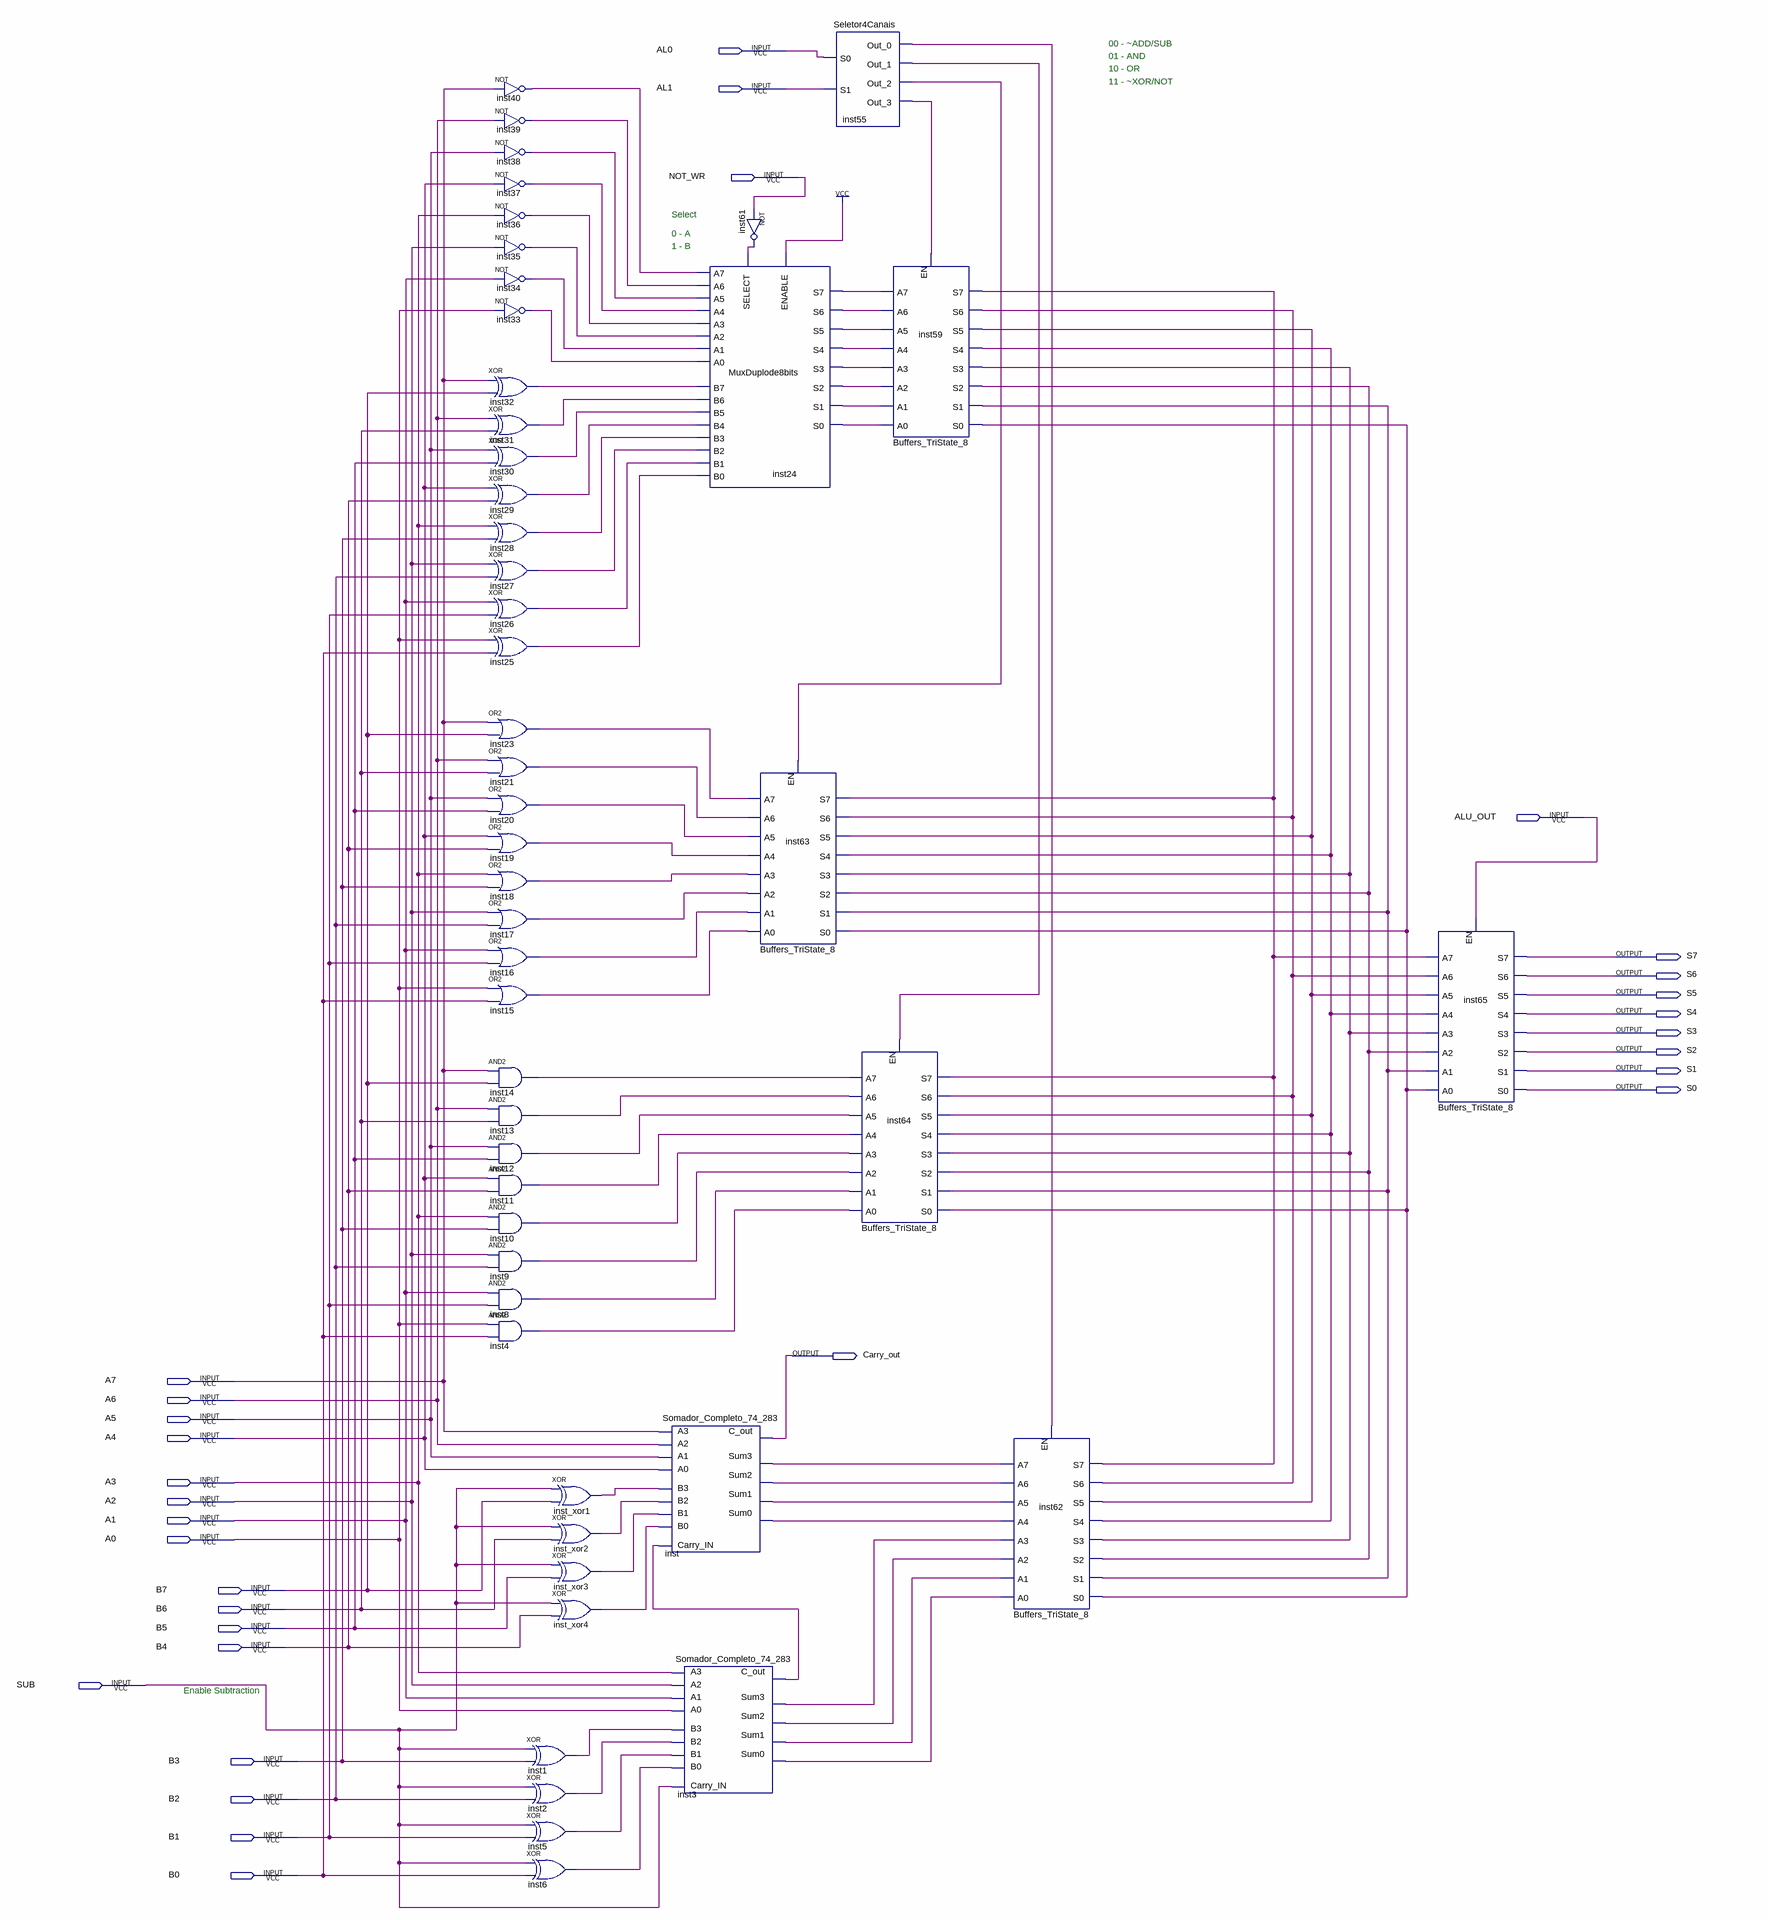
[diagram p0: schematic sheet]
// Quartus schematic ULA_Iago.bdf as structural Verilog: 50 symbols, 30 pins
module ULA_Iago (
  input  AL0,
  input  AL1,
  input  NOT_WR,
  input  ALU_OUT,
  input  A7,
  input  A6,
  input  A5,
  input  A4,
  input  A3,
  input  A2,
  input  A1,
  input  A0,
  input  B7,
  input  B6,
  input  B5,
  input  B4,
  input  SUB,
  input  B3,
  input  B2,
  input  B1,
  input  B0,
  output S7,
  output S6,
  output S5,
  output S4,
  output S3,
  output S2,
  output S1,
  output S0,
  output Carry_out
);

  wire inst1_out, inst2_out, inst3_c_out, inst3_sum0, inst3_sum1, inst3_sum2, inst3_sum3, inst4_out,
       inst5_out, inst6_out, inst8_out, inst9_out, inst10_out, inst11_out, inst12_out, inst13_out,
       inst14_out, inst15_out, inst16_out, inst17_out, inst18_out, inst19_out, inst20_out, inst21_out,
       inst23_out, inst24_s0, inst24_s1, inst24_s2, inst24_s3, inst24_s4, inst24_s5, inst24_s6, inst24_s7,
       inst25_out, inst26_out, inst27_out, inst28_out, inst29_out, inst30_out, inst31_out, inst32_out,
       inst33_out, inst34_out, inst35_out, inst36_out, inst37_out, inst38_out, inst39_out, inst40_out,
       inst55_out_0, inst55_out_1, inst55_out_2, inst55_out_3, inst61_out, inst63_s0, inst63_s1, inst63_s2,
       inst63_s3, inst63_s4, inst63_s5, inst63_s6, inst63_s7, inst_sum0, inst_sum1, inst_sum2, inst_sum3,
       inst_xor1_out, inst_xor2_out, inst_xor3_out, inst_xor4_out;

  not inst40 (inst40_out, A7);
  not inst39 (inst39_out, A6);
  not inst38 (inst38_out, A5);
  not inst37 (inst37_out, A4);
  not inst36 (inst36_out, A3);
  not inst35 (inst35_out, A2);
  not inst34 (inst34_out, A1);
  not inst33 (inst33_out, A0);
  xor inst32 (inst32_out, A7, B7);
  xor inst31 (inst31_out, A6, B6);
  xor inst30 (inst30_out, A5, B5);
  xor inst29 (inst29_out, A4, B4);
  xor inst28 (inst28_out, A3, B3);
  xor inst27 (inst27_out, A2, B2);
  xor inst26 (inst26_out, A1, B1);
  xor inst25 (inst25_out, A0, B0);
  or inst23 (inst23_out, A7, B7);
  or inst21 (inst21_out, A6, B6);
  or inst20 (inst20_out, A5, B5);
  or inst19 (inst19_out, A4, B4);
  or inst18 (inst18_out, A3, B3);
  or inst17 (inst17_out, A2, B2);
  or inst16 (inst16_out, A1, B1);
  or inst15 (inst15_out, A0, B0);
  and inst14 (inst14_out, A7, B7);
  and inst13 (inst13_out, A6, B6);
  and inst12 (inst12_out, A5, B5);
  and inst11 (inst11_out, A4, B4);
  and inst10 (inst10_out, A3, B3);
  and inst9 (inst9_out, A2, B2);
  and inst8 (inst8_out, A1, B1);
  and inst4 (inst4_out, A0, B0);
  xor inst_xor1 (inst_xor1_out, SUB, B7);
  xor inst_xor2 (inst_xor2_out, SUB, B6);
  xor inst_xor3 (inst_xor3_out, SUB, B5);
  xor inst_xor4 (inst_xor4_out, SUB, B4);
  xor inst1 (inst1_out, SUB, B3);
  xor inst2 (inst2_out, SUB, B2);
  xor inst5 (inst5_out, SUB, B1);
  xor inst6 (inst6_out, SUB, B0);
  Somador_Completo_74_283 inst (
    .B3(inst_xor1_out), .A3(A7), .B2(inst_xor2_out), .A2(A6), .B1(inst_xor3_out), .A1(A5),
    .B0(inst_xor4_out), .A0(A4), .Carry_IN(inst3_c_out), .C_out(Carry_out), .Sum3(inst_sum3),
    .Sum2(inst_sum2), .Sum0(inst_sum0), .Sum1(inst_sum1));
  MuxDuplode8bits inst24 (
    .SELECT(inst61_out), .ENABLE(1'b1), .A7(inst40_out), .B7(inst32_out), .A6(inst39_out), .B6(inst31_out),
    .A5(inst38_out), .B5(inst30_out), .A4(inst37_out), .B4(inst29_out), .A3(inst36_out), .B3(inst28_out),
    .A2(inst35_out), .B2(inst27_out), .A1(inst34_out), .B1(inst26_out), .A0(inst33_out), .B0(inst25_out),
    .S7(inst24_s7), .S6(inst24_s6), .S5(inst24_s5), .S4(inst24_s4), .S3(inst24_s3), .S2(inst24_s2),
    .S1(inst24_s1), .S0(inst24_s0));
  Somador_Completo_74_283 inst3 (
    .B3(inst1_out), .A3(A3), .B2(inst2_out), .A2(A2), .B1(inst5_out), .A1(A1), .B0(inst6_out), .A0(A0),
    .Carry_IN(SUB), .C_out(inst3_c_out), .Sum3(inst3_sum3), .Sum2(inst3_sum2), .Sum0(inst3_sum0),
    .Sum1(inst3_sum1));
  not inst61 (inst61_out, NOT_WR);
  Buffers_TriState_8 inst63 (
    .EN(inst55_out_2), .A7(inst23_out), .A6(inst21_out), .A5(inst20_out), .A4(inst19_out), .A3(inst18_out),
    .A2(inst17_out), .A1(inst16_out), .A0(inst15_out), .S7(inst63_s7), .S6(inst63_s6), .S5(inst63_s5),
    .S4(inst63_s4), .S3(inst63_s3), .S2(inst63_s2), .S1(inst63_s1), .S0(inst63_s0));
  Seletor4Canais inst55 (
    .S0(AL0), .S1(AL1), .Out_0(inst55_out_0), .Out_1(inst55_out_1), .Out_2(inst55_out_2), .Out_3(inst55_out_3));
  Buffers_TriState_8 inst64 (
    .EN(inst55_out_1), .A7(inst14_out), .A6(inst13_out), .A5(inst12_out), .A4(inst11_out), .A3(inst10_out),
    .A2(inst9_out), .A1(inst8_out), .A0(inst4_out), .S7(inst63_s7), .S6(inst63_s6), .S5(inst63_s5),
    .S4(inst63_s4), .S3(inst63_s3), .S2(inst63_s2), .S1(inst63_s1), .S0(inst63_s0));
  Buffers_TriState_8 inst59 (
    .EN(inst55_out_3), .A7(inst24_s7), .A6(inst24_s6), .A5(inst24_s5), .A4(inst24_s4), .A3(inst24_s3),
    .A2(inst24_s2), .A1(inst24_s1), .A0(inst24_s0), .S7(inst63_s7), .S6(inst63_s6), .S5(inst63_s5),
    .S4(inst63_s4), .S3(inst63_s3), .S2(inst63_s2), .S1(inst63_s1), .S0(inst63_s0));
  Buffers_TriState_8 inst62 (
    .EN(inst55_out_0), .A7(inst_sum3), .A6(inst_sum2), .A5(inst_sum1), .A4(inst_sum0), .A3(inst3_sum3),
    .A2(inst3_sum2), .A1(inst3_sum1), .A0(inst3_sum0), .S7(inst63_s7), .S6(inst63_s6), .S5(inst63_s5),
    .S4(inst63_s4), .S3(inst63_s3), .S2(inst63_s2), .S1(inst63_s1), .S0(inst63_s0));
  Buffers_TriState_8 inst65 (
    .EN(ALU_OUT), .A7(inst63_s7), .A6(inst63_s6), .A5(inst63_s5), .A4(inst63_s4), .A3(inst63_s3),
    .A2(inst63_s2), .A1(inst63_s1), .A0(inst63_s0), .S7(S7), .S6(S6), .S5(S5), .S4(S4), .S3(S3), .S2(S2),
    .S1(S1), .S0(S0));

  // Notes on the sheet:
  //   00 - ~ADD/SUB
  //   01 - AND
  //   10 - OR
  //   11 - ~XOR/NOT
  //   Select
  //   0 - A 
  //   1 - B
  //   Enable Subtraction
endmodule
